# Altium schematic sheet Limit_Switches.SchDoc: RP2040 CNC
size B; Author: AM; CompanyName: Expatria Technologies; DrawnBy: A.Marles; Engineer: AM; Organization: Expatria Technolgoies; Address1: PO Box 2084; Address3: Merritt, BC V1K 1B8; Address4: Canada; DocumentNumber: 22; SheetNumber: 19; SheetTotal: 26
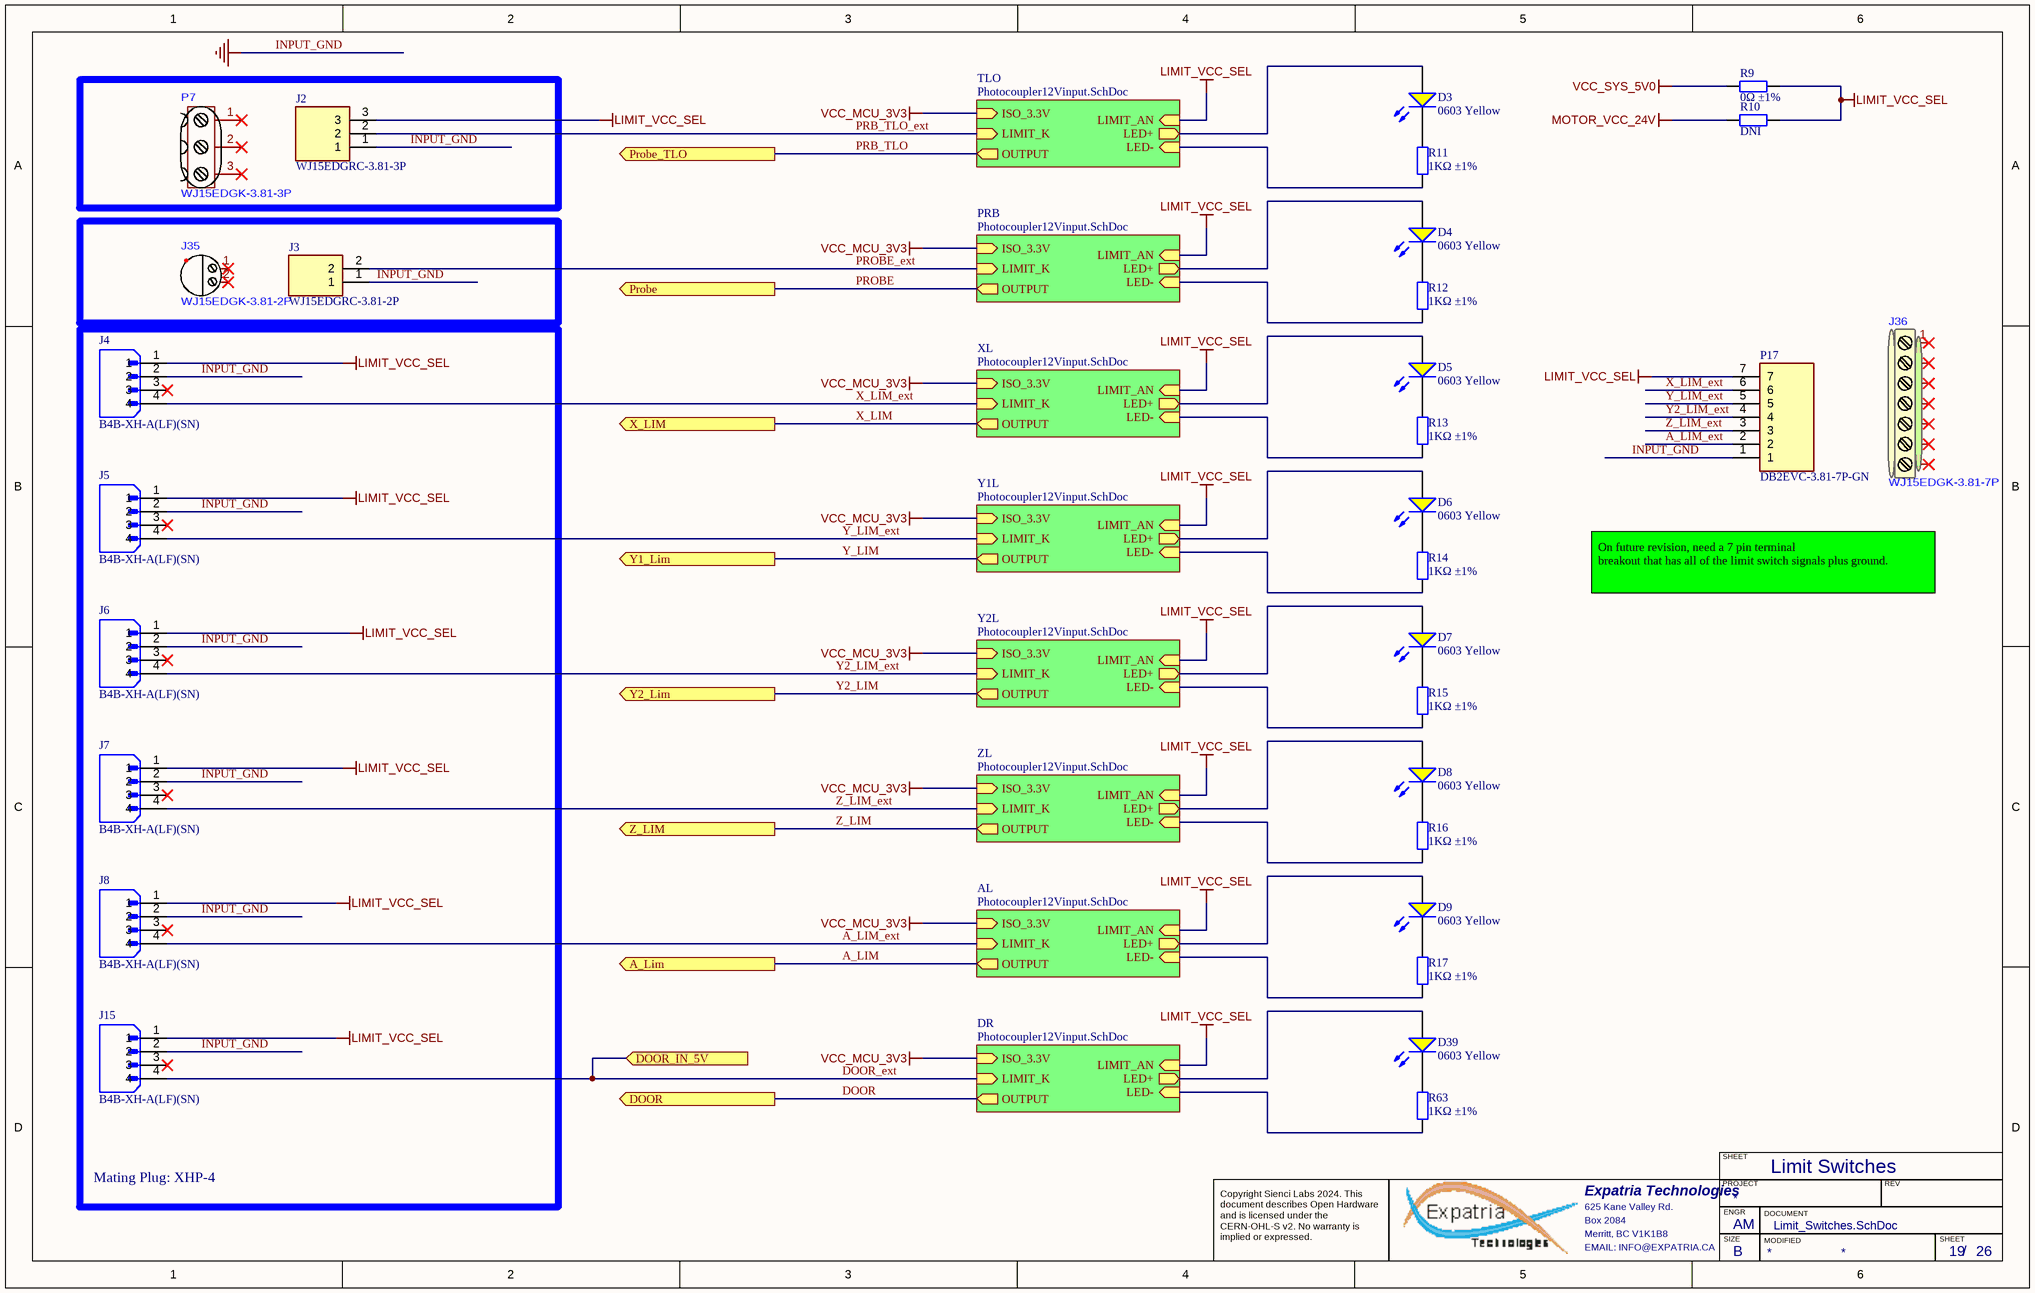
[diagram p0: Limit_Switches.SchDoc]

## Parts
D3  0603 Yellow  [0603_LED_S1 - YELLOW]
D4  0603 Yellow  [0603_LED_S1 - YELLOW]
D5  0603 Yellow  [0603_LED_S1 - YELLOW]
D6  0603 Yellow  [0603_LED_S1 - YELLOW]
D7  0603 Yellow  [0603_LED_S1 - YELLOW]
D8  0603 Yellow  [0603_LED_S1 - YELLOW]
D9  0603 Yellow  [0603_LED_S1 - YELLOW]
D39  0603 Yellow  [0603_LED_S1 - YELLOW]
J2  WJ15EDGRC-3.81-3P  [SHDRRA3W85P0X381_1X3_1231X915X720P]
J3  WJ15EDGRC-3.81-2P  [SHDRRA2W85P0X381_1X2_850X915X720P]
J4  B4B-XH-A(LF)(SN)  [JST_B4B-XH-A(LF)(SN)]
J5  B4B-XH-A(LF)(SN)  [JST_B4B-XH-A(LF)(SN)]
J6  B4B-XH-A(LF)(SN)  [JST_B4B-XH-A(LF)(SN)]
J7  B4B-XH-A(LF)(SN)  [JST_B4B-XH-A(LF)(SN)]
J8  B4B-XH-A(LF)(SN)  [JST_B4B-XH-A(LF)(SN)]
J15  B4B-XH-A(LF)(SN)  [JST_B4B-XH-A(LF)(SN)]
J35  WJ15EDGK-3.81-2P  (mechanical)
J36  WJ15EDGK-3.81-7P  (mechanical)
P7  WJ15EDGK-3.81-3P  (mechanical)
P17  DB2EVC-3.81-7P-GN  [CONN-TH_5P-P3.81_DB2EVC-3.81-7P]
R9  0Ω ±1%  [0603_R]
R10  DNI  [0603_R]
R11  1KΩ ±1%  [0402_R]
R12  1KΩ ±1%  [0402_R]
R13  1KΩ ±1%  [0402_R]
R14  1KΩ ±1%  [0402_R]
R15  1KΩ ±1%  [0402_R]
R16  1KΩ ±1%  [0402_R]
R17  1KΩ ±1%  [0402_R]
R63  1KΩ ±1%  [0402_R]

## Blocks framed on the sheet
Mating Plug: XHP-4: J4-J8 J15

## Sub-sheets
AL = Photocoupler12Vinput.SchDoc: OUTPUT (out), LED+ (out), LED- (in), ISO_3.3V (in), LIMIT_AN (in), LIMIT_K (in)
DR = Photocoupler12Vinput.SchDoc: OUTPUT (out), LED+ (out), LED- (in), ISO_3.3V (in), LIMIT_AN (in), LIMIT_K (in)
PRB = Photocoupler12Vinput.SchDoc: OUTPUT (out), LED+ (out), LED- (in), ISO_3.3V (in), LIMIT_AN (in), LIMIT_K (in)
TLO = Photocoupler12Vinput.SchDoc: OUTPUT (out), LED+ (out), LED- (in), ISO_3.3V (in), LIMIT_AN (in), LIMIT_K (in)
XL = Photocoupler12Vinput.SchDoc: OUTPUT (out), LED+ (out), LED- (in), ISO_3.3V (in), LIMIT_AN (in), LIMIT_K (in)
Y1L = Photocoupler12Vinput.SchDoc: OUTPUT (out), LED+ (out), LED- (in), ISO_3.3V (in), LIMIT_AN (in), LIMIT_K (in)
Y2L = Photocoupler12Vinput.SchDoc: OUTPUT (out), LED+ (out), LED- (in), ISO_3.3V (in), LIMIT_AN (in), LIMIT_K (in)
ZL = Photocoupler12Vinput.SchDoc: OUTPUT (out), LED+ (out), LED- (in), ISO_3.3V (in), LIMIT_AN (in), LIMIT_K (in)

## Ports
A_Lim (out), DOOR (out), DOOR_IN_5V (in), Probe (out), Probe_TLO (out), X_LIM (out), Y1_Lim (out), Y2_Lim (out), Z_LIM (out)

## Nets
INPUT_GND: J2.1 J3.1 J4.2 J5.2 J6.2 J7.2 J8.2 J15.2 P17.1  [also labelled GND]
LIMIT_VCC_SEL: J2.3 J4.1 J5.1 J6.1 J7.1 J8.1 J15.1 P17.7 R9.2 R10.2 ; sheet TLO/LIMIT_AN, sheet PRB/LIMIT_AN, sheet XL/LIMIT_AN, sheet Y1L/LIMIT_AN, sheet Y2L/LIMIT_AN, sheet ZL/LIMIT_AN, sheet AL/LIMIT_AN, sheet DR/LIMIT_AN
MOTOR_VCC_24V: R10.1
VCC_MCU_3V3: sheet TLO/ISO_3.3V, sheet PRB/ISO_3.3V, sheet XL/ISO_3.3V, sheet Y1L/ISO_3.3V, sheet Y2L/ISO_3.3V, sheet ZL/ISO_3.3V, sheet AL/ISO_3.3V, sheet DR/ISO_3.3V
VCC_SYS_5V0: R9.1
A_LIM: port A_Lim, sheet AL/OUTPUT
A_LIM_ext: J8.4 P17.2 ; sheet AL/LIMIT_K
DOOR: port DOOR, sheet DR/OUTPUT
DOOR_ext: J15.4 ; port DOOR_IN_5V, sheet DR/LIMIT_K
PRB_TLO: port Probe_TLO, sheet TLO/OUTPUT
PRB_TLO_ext: J2.2 ; sheet TLO/LIMIT_K
PROBE: port Probe, sheet PRB/OUTPUT
PROBE_ext: J3.2 ; sheet PRB/LIMIT_K
X_LIM: port X_LIM, sheet XL/OUTPUT
X_LIM_ext: J4.4 P17.6 ; sheet XL/LIMIT_K
Y2_LIM: port Y2_Lim, sheet Y2L/OUTPUT
Y2_LIM_ext: J6.4 P17.4 ; sheet Y2L/LIMIT_K
Y_LIM: port Y1_Lim, sheet Y1L/OUTPUT
Y_LIM_ext: J5.4 P17.5 ; sheet Y1L/LIMIT_K
Z_LIM: port Z_LIM, sheet ZL/OUTPUT
Z_LIM_ext: J7.4 P17.3 ; sheet ZL/LIMIT_K
NetD3_A: D3.A ; sheet TLO/LED+
NetD3_K: D3.K R11.1
NetD4_A: D4.A ; sheet PRB/LED+
NetD4_K: D4.K R12.1
NetD5_A: D5.A ; sheet XL/LED+
NetD5_K: D5.K R13.1
NetD6_A: D6.A ; sheet Y1L/LED+
NetD6_K: D6.K R14.1
NetD7_A: D7.A ; sheet Y2L/LED+
NetD7_K: D7.K R15.1
NetD8_A: D8.A ; sheet ZL/LED+
NetD8_K: D8.K R16.1
NetD9_A: D9.A ; sheet AL/LED+
NetD9_K: D9.K R17.1
NetD39_A: D39.A ; sheet DR/LED+
NetD39_K: D39.K R63.1
NetR11_2: R11.2 ; sheet TLO/LED-
NetR12_2: R12.2 ; sheet PRB/LED-
NetR13_2: R13.2 ; sheet XL/LED-
NetR14_2: R14.2 ; sheet Y1L/LED-
NetR15_2: R15.2 ; sheet Y2L/LED-
NetR16_2: R16.2 ; sheet ZL/LED-
NetR17_2: R17.2 ; sheet AL/LED-
NetR63_2: R63.2 ; sheet DR/LED-

Not connected (* = marked no-connect by the designer): J4 3*; J5 3*; J6 3*; J7 3*; J8 3*; J15 3*; J35 1* 2*; J36 1* 2* 3* 4* 5* 6* 7*; P7 1* 2* 3*

## Notes on the sheet
- On future revision, need a 7 pin terminal
  breakout that has all of the limit switch signals plus ground.
- Limit Switches
- SHEET
- Expatria Technologies
- 625 Kane Valley Rd.
- Box 2084
- Merritt, BC V1K1B8
- PROJECT
- SIZE
- ENGR
- MODIFIED
- DOCUMENT
- REV
- Copyright Sienci Labs 2024. This document describes Open Hardware and is licensed under the CERN-OHL-S v2. No warranty is implied or expressed.
- EMAIL: INFO@EXPATRIA.CA
- B
- /

## Library data of the parts
D3-D9 D39 = 0603 LED Yellow: LED; Manufacturer Part Number: 19-213/Y2C-CQ2R2L/3T(CY); Manufacturer: Everlight Elec; ComponentLink1Description: 供应商链接; ComponentLink1URL: http://www.szlcsc.com/product/details_73147.html; Package: 0603; Supplier: LC; SuppliersPartNumber: C72038; Color: Yellow
J2 = WJ15EDGRC-3.81-3P: 3.81mm Green Board Edge/Receptacle-Close Push-Pull,P=3.81mm Pluggable System Terminal Block ROHS; Manufacturer: Ningbo Kangnex; SuppliersPartNumber: C8406; Datasheet Link: https://datasheet.lcsc.com/szlcsc/1912251633_Ningbo-Kangnex-Elec-WJ15EDGRC-3-81-3P_C8406.pdf; Height: 7.2mm; Manufacturer Part Number: WJ15EDGRC-3.81-3P
J3 = WJ15EDGRC-3.81-2P: 3.81mm Green Board Edge/Receptacle-Close Push-Pull,P=3.81mm Pluggable System Terminal Block ROHS; Manufacturer: Ningbo Kangnex; Manufacturer Part Number: WJ15EDGRC-3.81-2P; SuppliersPartNumber: C8387; Datasheet Link: https://datasheet.lcsc.com/szlcsc/Ningbo-Kangnex-Elec-WJ15EDGRC-3-81-2P_C8387.pdf; Height: 7.2mm
J4-J8 J15 = B4B-XH-A(LF)(SN): XH Series 4 Position 2.5 mm Pitch Through Hole Crimp Top Entry Shrouded Header; Manufacturer: JST; Current Rating: 3A; Contact Resistance: 20mR; Voltage Rating (AC): 250V; Number of Positions: 4; Insulation Resistance: 1GR; Gender: Male; Pitch: 2.5mm; Wire/Cable Gauge: 22AWG; Mated Stacking Heights: 9.8mm; Manufacturer Part Number: B4B-XH-A(LF)(SN); SuppliersPartNumber: C144395; MP: B4B-XH-A(LF)(SN); Value: B4B-XH-A(LF)(SN); Price: None; Availability: Unavailable; Package: None; Supplier 1: LCSC; Supplier Part Number 1: C144395; RoHS: Yes; Category: FFC / FPC; Stock 1: 1735490; Pricing 1: 10=0.058800, 100=0.049000, 500=0.039500, 1000=0.039800, 5000=0.038300, 10000=0.037300 (USD); Mount: Through Hole; Contact Material: Brass; Contact Plating: Tin,Lead,Copper; Color: Natural; Housing Color: White; Housing Material: Polyamide; Material: Polyamide; Contact Shape: Square; Contact Finish - Mating: TIN; Insulation Material: Nylon; Insulation Color: Natural; Min Operating Temperature: -25°C; Max Operating Temperature: 85°C; Number of Rows: 1; Max Current Rating: 3A; Package Quantity: 500; Packaging: Bulk; Voltage Rating: 250V; Termination: Solder; Max Voltage Rating (AC): 250V; Max Voltage Rating (DC): 250V; Number of Contacts: 4; Orientation: Straight; Connector Type: Header; Series: XH; Contact Type: Male Pin; Fastening Type: Detent; Length: 12.4mm; Lead Pitch: 2.5mm; Depth: 5.75mm; Reach SVHC Compliant: Yes; Lead Free: Lead Free; Flammability Rating: UL94 V-0; ComponentLink1URL: https://datasheet.ciiva.com/16203/b4b-xh-alfsn-16203642.pdf?src-supplier=Future+Electronics; ComponentLink1Description: https://datasheet.ciiva.com/16203/b4b-xh-alfsn-16203642.pdf?src-supplier=Future+Electronics; ComponentLink2URL: https://datasheet.ciiva.com/26894/getdatasheetpartid-455616-26894787.pdf?src-supplier=Verical; ComponentLink2Description: https://datasheet.ciiva.com/26894/getdatasheetpartid-455616-26894787.pdf?src-supplier=Verical; ComponentLink3URL: https://datasheet.ciiva.com/26924/getdatasheetpartid-640571-26924035.pdf?src-supplier=Verical; ComponentLink3Description: https://datasheet.ciiva.com/26924/getdatasheetpartid-640571-26924035.pdf?src-supplier=Verical; ComponentLink4URL: https://datasheet.ciiva.com/726/exh-726404.pdf?src-supplier=Digi-Key; ComponentLink4Description: https://datasheet.ciiva.com/726/exh-726404.pdf?src-supplier=Digi-Key
J35 = WJ15EDGK-3.81-2P: 2 1 3.81mm Green Plug P=3.81mm Pluggable System Terminal Block ROHS; Manufacturer: Ningbo; Supplier: LCSC; Supplier Part Number 1: C8466; Manufacturer Part Number: WJ15EDGK-3.81-2P; RoHS: Yes; SuppliersPartNumber: C8466
J36 = WJ15EDGK-3.81-7P: 3.81mm 1x7P Green Plug P=3.81mm Pluggable System Terminal Block ROHS; Manufacturer: Kangnex; SuppliersPartNumber: C24527; Manufacturer Part Number: WJ15EDGK-3.81-7P; Supplier 1: LCSC; Supplier Part Number 1: C24527; RoHS: No
P7 = WJ15EDGK-3.81-3P: 3.81mm Green Plug P=3.81mm Pluggable System Terminal Block ROHS; Manufacturer: Ningbo; Value: WJ15EDGK-3.81-3P; SuppliersPartNumber: C8413; Supplier: LCSC; Manufacturer Part Number: WJ15EDGK-3.81-3P
P17 = DB2EVC-3.81-7P-GN: 3.81mm Green Board Edge/Receptacle-Close Push-Pull,P=3.81mm Pluggable System Terminal Block ROHS; Manufacturer: DIBO; Manufacturer Part Number: DB2EVC-3.81-7P-GN; SuppliersPartNumber: C430333; Supplier: LCSC; Value: DB2EVC-3.81-7P-GN
R9 = 0603 0R (0R0) 1%: Chip resistor; Manufacturer: Uniroyal Elec; Manufacturer Part Number: 0603WAF0000T5E; Power: 1/10W; ComponentLink1Description: Supplier link; ComponentLink1URL: http://www.szlcsc.com/product/details_21903.html; Package: 0603; Supplier: LCSC; SuppliersPartNumber: C21189; Resistance: 0Ω; Tolerance: 1%
R10 = 0603 0R (0R0) 1%: Chip resistor; Manufacturer: Uniroyal Elec; Manufacturer Part Number: 0603WAF0000T5E; Power: 1/10W; Resistance: 0Ω; Tolerance: 1%; ComponentLink1Description: Supplier link; ComponentLink1URL: http://www.szlcsc.com/product/details_21903.html; Package: 0603; Supplier: LCSC; SuppliersPartNumber: C21189
R11-R17 R63 = 0402 1K (1001) 1%: Chip resistor; Manufacturer: Uniroyal Elec; Manufacturer Part Number: 0402WGF1001TCE; Power: 1/16W; ComponentLink1Description: Supplier link; ComponentLink1URL: http://www.szlcsc.com/product/details_12256.html; Package: 0402; Supplier: LC; SuppliersPartNumber: C11702; Resistance: 1KΩ; Tolerance: 1%